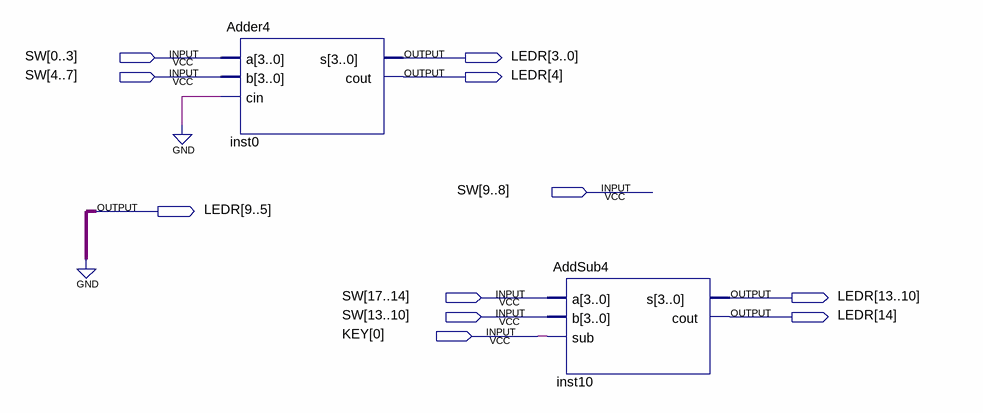
[diagram p0: schematic sheet]
// Quartus schematic AdderDemo.bdf as structural Verilog: 2 symbols, 11 pins
module AdderDemo (
  input  [0:17] SW,
  input  [0:0] KEY,
  output [14:0] LEDR
);

  Adder4 inst0 (.a(SW[0:3]), .b(SW[4:7]), .cin(1'b0), .s(LEDR[3:0]), .cout(LEDR[4]));
  AddSub4 inst10 (
    .a({SW[17], SW[16], SW[15], SW[14]}), .b({SW[13], SW[12], SW[11], SW[10]}), .sub(KEY[0]),
    .s(LEDR[13:10]), .cout(LEDR[14]));

  assign LEDR[9:5] = {5{1'b0}};
endmodule
